# EasyEDA schematic RejsaCAN v6.0 - Schematic.json
TITLE: RejsaCAN v6.0; REV: 1.0; Date: 2023-11-16; Sheet: 1/1; Drawn By: MagnusT
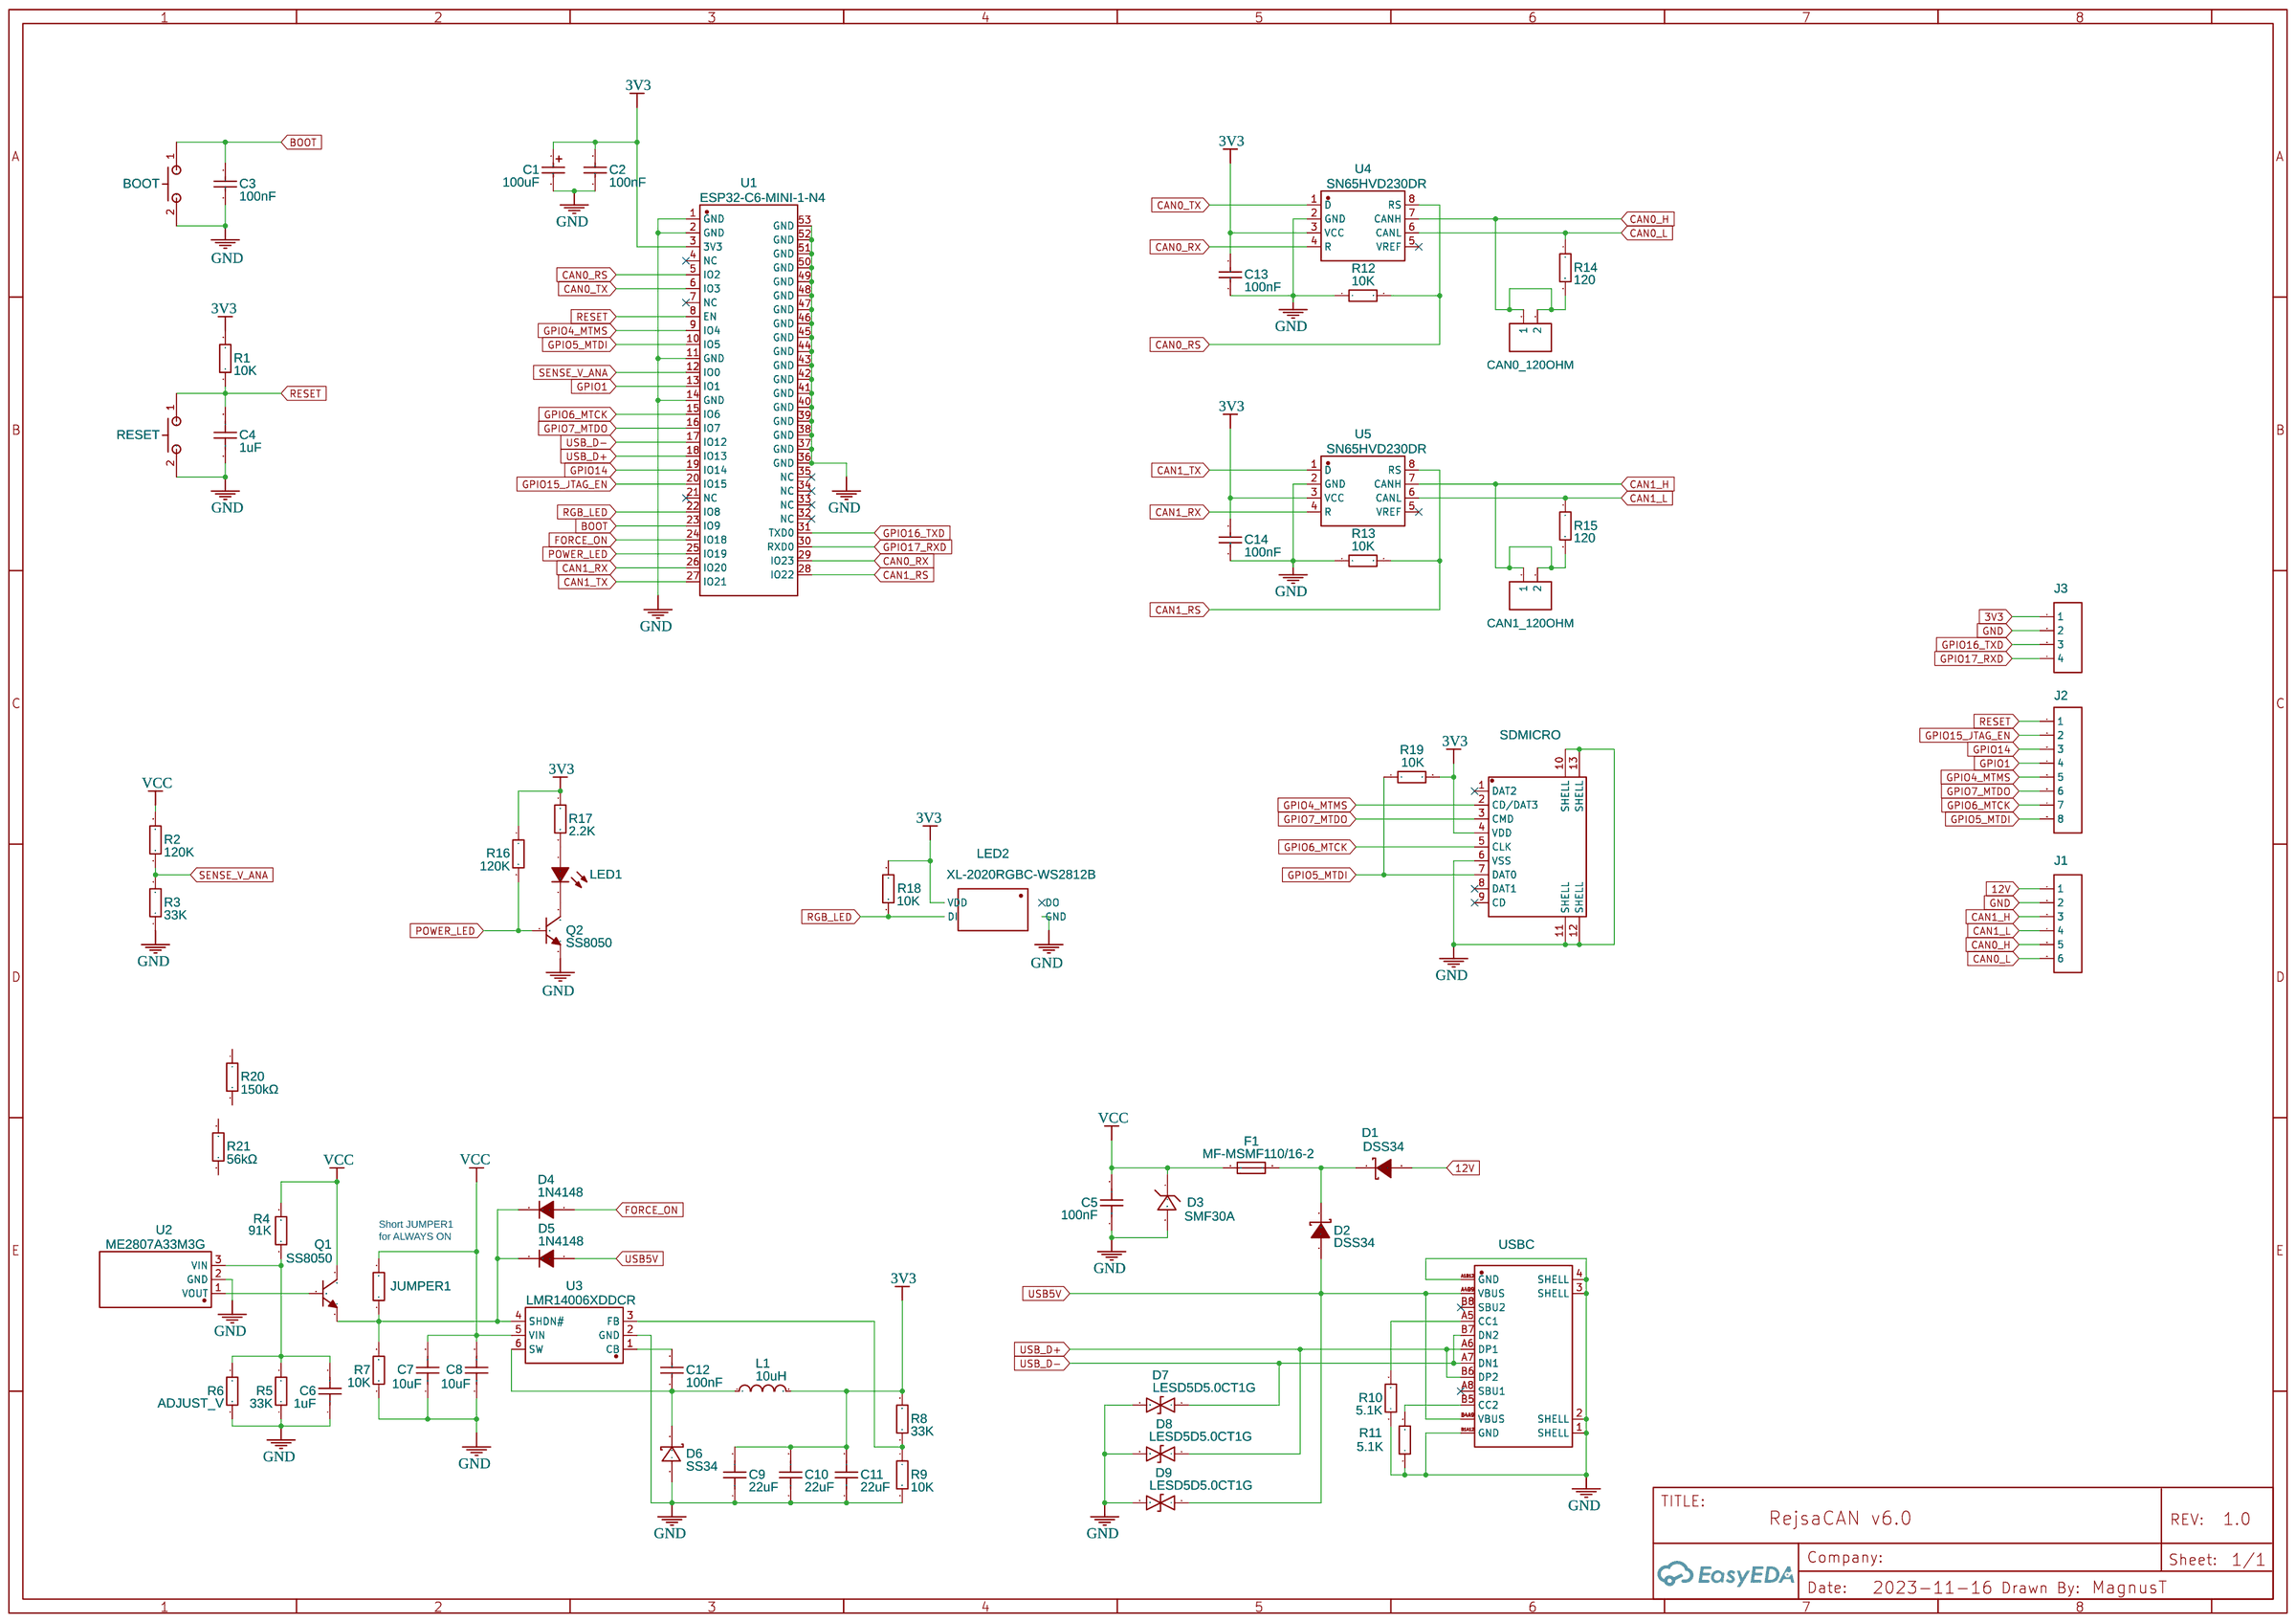
[diagram p0: schematic sheet]

## Parts
BOOT  GT-TC029B-H025-L1N  [SW-SMD_L3.9-W2.9-P4.15-LS5.0]
C1  100uF  [CASE-B_3528]
C2  100nF  [C0402_NEW]
C3  100nF  [C0402_NEW]
C4  1uF  [C0402]
C5  100nF  [C0402]
C6  1uF  [C0402]
C7  10uF  [C0805]
C8  10uF  [C0805]
C9  22uF  [C0603]
C10  22uF  [C0603]
C11  22uF  [C0603]
C12  100nF  [C0402_NEW]
C13  100nF  [C0402_NEW]
C14  100nF  [C0402_NEW]
CAN0_120OHM  HDR-M-2.54_1x2  [HDR-M-2.54_1X2]
CAN1_120OHM  HDR-M-2.54_1x2  [HDR-M-2.54_1X2]
D1  DSS34  [SOD-123_L2.8-W1.8-LS3.7-RD]
D2  DSS34  [SOD-123_L2.8-W1.8-LS3.7-RD]
D3  SMF30A  [SOD-123_L2.8-W1.8-LS3.7-RD]
D4  1N4148  [SOD-323_L1.8-W1.3-LS2.5-RD]
D5  1N4148  [SOD-323_L1.8-W1.3-LS2.5-RD]
D6  SS34  [DO-214AC_L4.3-W2.7-LS5.3-RD]
D7  LESD5D5.0CT1G  [SOD-523_L1.2-W0.8-LS1.6-BI]
D8  LESD5D5.0CT1G  [SOD-523_L1.2-W0.8-LS1.6-BI]
D9  LESD5D5.0CT1G  [SOD-523_L1.2-W0.8-LS1.6-BI]
F1  MF-MSMF110/16-2  [F1812]
J1  HDR-M-2.54_1x6  [HDR-M-2.54_1X6]
J2  HDR-M-2.54_1x8  [HDR-M-2.54_1X8]
J3  HDR-M-2.54_1x4  [HDR-M-2.54_1X4]
JUMPER1  CUT  [R0402]
L1  10uH  [IND-SMD_L6.0-W6.0_SLP6028S]
LED1  19-217/GHC-YR1S2/3T  [LED0603-R-RD]
LED2  XL-2020RGBC-WS2812B  [LED-SMD_4P-L2.0-W2.0-BR-1]
Q1  SS8050  [SOT-23-3_L2.9-W1.3-P1.90-LS2.4-BR]
Q2  SS8050  [SOT-23-3_L2.9-W1.3-P1.90-LS2.4-BR]
R1  10K  [R0402]
R2  120K  [R0402]
R3  33K  [R0402]
R4  91K  [R0402]
R5  33K  [R0402]
R6  ADJUST_V  [R0805]
R7  10K  [R0402]
R8  33K  [R0402]
R9  10K  [R0402]
R10  5.1K  [R0402]
R11  5.1K  [R0402]
R12  10K  [R0402]
R13  10K  [R0402]
R14  120  [R1206]
R15  120  [R1206]
R16  120K  [R0402]
R17  2.2K  [R0402]
R18  10K  [R0402]
R19  10K  [R0402]
R20  150kΩ  [R0402]
R21  56kΩ  [R0402]
RESET  GT-TC029B-H025-L1N  [SW-SMD_L3.9-W2.9-P4.15-LS5.0]
SDMICRO  TF-115  [TF-SMD_TF-115]
U1  ESP32-C6-MINI-1-N4  [WIFIM-SMD_ESP32-C3-MINI-1]
U2  ME2807A33M3G  [SOT-23_L2.9-W1.3-P1.90-LS2.4-BR]
U3  LMR14006XDDCR  [TSOT-23-6_L2.9-W1.6-P0.95-LS2.8-BL]
U4  SN65HVD230DR  [SOIC-8_L4.9-W3.9-P1.27-LS6.0-BL]
U5  SN65HVD230DR  [SOIC-8_L4.9-W3.9-P1.27-LS6.0-BL]
USBC  GT-USB-7010ASV  [USB-C-SMD_G-SWITCH_GT-USB-7010ASV]

## Library data of the parts
BOOT RESET = GT-TC029B-H025-L1N: Supplier: LCSC; Supplier Part: C843669; Manufacturer: G-Switch; Contributor: LCSC; JLCPCB Part Class: Extended Part; Package Display: No
C1 = TAJB107K006RNJ: Supplier: LCSC; Manufacturer: Kyocera AVX; Supplier Part: C16133; JLCPCB Part Class: Basic Part; link: https://lcsc.com/eda_search?q=C16133&%26type=1&ref=editor
C2 C3 C12-C14 = CL05B104KO5NNNC: Supplier: LCSC; Manufacturer: SAMSUNG; Supplier Part: C1525; JLCPCB Part Class: Basic Part; Package Display: No
C4 C6 = CL05A105KA5NQNC: Supplier: LCSC; Manufacturer: SAMSUNG; Supplier Part: C52923; JLCPCB Part Class: Basic Part; Package Display: No
C5 = CL05B104KB54PNC: Supplier: LCSC; Supplier Part: C307331; Manufacturer: Samsung Electro-Mechanics; Contributor: LCSC; JLCPCB Part Class: Basic Part
C7 C8 = CL21A106KBYQNNE: Contributor: lcsc; Supplier: LCSC; Supplier Part: C2932476; Manufacturer: SAMSUNG(三星); JLCPCB Part Class: Extended Part; link: https://lcsc.com/eda_search?q=C2932476&%26type=1&ref=editor
C9-C11 = CL10A226MQ8NRNC: Supplier: LCSC; Manufacturer: SAMSUNG; Supplier Part: C59461; JLCPCB Part Class: Basic Part; Package Display: No
CAN0_120OHM CAN1_120OHM = HDR-M-2.54_1x2: Supplier Part: C124375; Supplier: LCSC; Contributor: LCEDA_Lib
D1 D2 = DSS34: Supplier: LCSC; Manufacturer: STARSEA; Supplier Part: C84632; JLCPCB Part Class: Extended Part
D3 = SMF30A_C366558: Supplier: LCSC; Supplier Part: C366558; Manufacturer: DOWO; Contributor: LCSC; JLCPCB Part Class: Extended Part
D4 D5 = 1N4148WS T4: Supplier: LCSC; Manufacturer: CJ; Supplier Part: C2128; JLCPCB Part Class: Basic Part; Package Display: No
D6 = SS34_C8678: Supplier: LCSC; Manufacturer: MDD; Supplier Part: C8678; JLCPCB Part Class: Basic Part; Package Display: No
D7-D9 = LESD5D5.0CT1G: Supplier: LCSC; Supplier Part: C383211; Manufacturer: Leshan Radio; Contributor: LCSC; JLCPCB Part Class: Extended Part
F1 = MF-MSMF110/16-2: Contributor: LCSC; Supplier: LCSC; Supplier Part: C210834; Manufacturer: BOURNS; JLCPCB Part Class: Extended Part; link: https://lcsc.com/eda_search?q=C210834&%26type=1&ref=editor
J1 = HDR-M-2.54_1x6: Supplier Part: C190819; Supplier: LCSC; Contributor: LCEDA_Lib
J2 = HDR-M-2.54_1x8: Supplier Part: C190820; Supplier: LCSC; Contributor: LCEDA_Lib
J3 = HDR-M-2.54_1x4: Supplier Part: C124378; Supplier: LCSC; Contributor: LCEDA_Lib
JUMPER1 = 0402WGF3092TCE: Contributor: LCSC
L1 = SLP6028S100MTT: Supplier: LCSC; Supplier Part: C254862; Manufacturer: Sunltech Tech; Contributor: LCSC; JLCPCB Part Class: Extended Part
LED1 = 19-217/GHC-YR1S2/3T: Supplier: LCSC; Manufacturer: EVERLIGHT; Supplier Part: C72043; JLCPCB Part Class: Basic Part; Package Display: No
LED2 = XL-2020RGBC-WS2812B: Supplier: LCSC; Supplier Part: C5349955; Manufacturer: XINGLIGHT(成兴光); JLCPCB Part Class: Extended Part; Contributor: lcsc; link: https://lcsc.com/eda_search?q=C5349955&%26type=1&ref=editor
Q1 Q2 = SS8050_C2150: Supplier: LCSC; Manufacturer: CJ; Supplier Part: C2150; JLCPCB Part Class: Basic Part; Package Display: No
R1 R7 R9 R12 R13 R18 = 0402WGF1002TCE: Supplier: LCSC; Manufacturer: UniOhm; Supplier Part: C25744; JLCPCB Part Class: Basic Part; Package Display: No
R2 R16 = 0402WGF1203TCE: Supplier: LCSC; Manufacturer: UniOhm; Supplier Part: C25750; JLCPCB Part Class: Basic Part
R3 R5 R8 = 0402WGF3302TCE: Supplier: LCSC; Manufacturer: UniOhm; Supplier Part: C25779; JLCPCB Part Class: Basic Part
R4 = 0402WGF9102TCE: Supplier: LCSC; Manufacturer: UniOhm; Supplier Part: C4147; JLCPCB Part Class: Extended Part
R6 = RC0805JR-131KL: Contributor: lcsc
R10 R11 = 0402WGF5101TCE: Supplier: LCSC; Manufacturer: UniOhm; Supplier Part: C25905; JLCPCB Part Class: Basic Part
R14 R15 = RTT061200FTP: Supplier: LCSC; Manufacturer: RALEC; Contributor: LCSC; Supplier Part: C159715; JLCPCB Part Class: Extended Part; Package Display: No
R17 = 0402WGF2201TCE: Supplier: LCSC; Manufacturer: UniOhm; Supplier Part: C25879; JLCPCB Part Class: Basic Part; Package Display: No
R19 = 0402WGF1002TCE: Supplier: LCSC; Manufacturer: UniOhm; Supplier Part: C25744; JLCPCB Part Class: Basic Part
R20 = 0402WGF1503TCE: Supplier: LCSC; Manufacturer: UNI-ROYAL(厚声); Supplier Part: C25755; JLCPCB Part Class: Basic Part
R21 = 0402WGF5602TCE: Supplier: LCSC; Manufacturer: UNI-ROYAL(厚声); Supplier Part: C25796; JLCPCB Part Class: Basic Part
SDMICRO = TF-115: Contributor: LCSC; Supplier: LCSC; Supplier Part: C266620; Manufacturer: XUNPU(讯普); JLCPCB Part Class: Extended Part; link: https://lcsc.com/eda_search?q=C266620&%26type=1&ref=editor
U1 = ESP32-C3-MINI-1-H4(4MB): Contributor: lcsc; Supplier: LCSC; Supplier Part: C5736265; Manufacturer: ESPRESSIF(乐鑫); JLCPCB Part Class: Extended Part; link: https://lcsc.com/eda_search?q=C5736265&%26type=1&ref=editor
U2 = ME2807A33M3G: Supplier: LCSC; Supplier Part: C236755; Manufacturer: Nanjing Micro One Elec; Contributor: LCSC; JLCPCB Part Class: Extended Part
U3 = LMR14006XDDCR: Supplier: LCSC; Supplier Part: C478074; Manufacturer: Texas Instruments; Contributor: LCSC; JLCPCB Part Class: Extended Part
U4 U5 = SN65HVD230DR: Supplier: LCSC; Manufacturer: TI; Supplier Part: C12084; JLCPCB Part Class: Basic Part; Package Display: No
USBC = GT-USB-7010ASV: Contributor: lcsc; Supplier: LCSC; Supplier Part: C2988369; Manufacturer: G-Switch(品赞); JLCPCB Part Class: Extended Part; link: https://lcsc.com/eda_search?q=C2988369&%26type=1&ref=editor

## Nets
3V3: C1.1 C2.2 C9.2 C10.2 C11.2 C13.2 C14.2 J3.1 L1.2 LED2.4(VDD) R1.2 R8.2 R16.1 R17.1 R18.2 R19.2 SDMICRO.4(VDD) U1.3(3V3) U4.3(VCC) U5.3(VCC)
12V: D1.2(A) J1.1
GND: BOOT.2 C1.2 C2.1 C3.1 C4.1 C5.1 C6.1 C7.1 C8.1 C9.1 C10.1 C11.1 C13.1 C14.1 D3.2 D6.2(A) D7.2 D8.2 D9.2 J1.2 J3.2 LED2.2(GND) Q2.2(E) R3.1 R5.1 R6.2 R7.1 R9.2 R10.1 R11.1 R12.1 R13.1 RESET.2 SDMICRO.6(VSS) SDMICRO.10(SHELL) SDMICRO.11(SHELL) SDMICRO.12(SHELL) SDMICRO.13(SHELL) U1.1(GND) U1.2(GND) U1.11(GND) U1.14(GND) U1.36(GND) U1.37(GND) U1.38(GND) U1.39(GND) U1.40(GND) U1.41(GND) U1.42(GND) U1.43(GND) U1.44(GND) U1.45(GND) U1.46(GND) U1.47(GND) U1.48(GND) U1.49(GND) U1.50(GND) U1.51(GND) U1.52(GND) U1.53(GND) U2.2(GND) U3.2(GND) U4.2(GND) U5.2(GND) USBC.1(SHELL) USBC.2(SHELL) USBC.3(SHELL) USBC.4(SHELL) USBC.A1B12(GND) USBC.B1A12(GND)
VCC: C5.2 C7.2 C8.2 D3.1 F1.1 JUMPER1.2 Q1.3(C) R2.2 R4.2 U3.5(VIN)
BOOT: BOOT.1 C3.2 U1.23(IO9)
CAN0_H: CAN0_120OHM.1 CAN0_120OHM.2 J1.5 R14.2 U4.7(CANH)
CAN0_L: J1.6 R14.1 U4.6(CANL)
CAN0_RS: R12.2 U1.5(IO2) U4.8(RS)
CAN0_RX: U1.29(IO23) U4.4(R)
CAN0_TX: U1.6(IO3) U4.1(D)
CAN1_H: CAN1_120OHM.1 CAN1_120OHM.2 J1.3 R15.2 U5.7(CANH)
CAN1_L: J1.4 R15.1 U5.6(CANL)
CAN1_RS: R13.2 U1.28(IO22) U5.8(RS)
CAN1_RX: U1.26(IO20) U5.4(R)
CAN1_TX: U1.27(IO21) U5.1(D)
FORCE_ON: D4.2(A) U1.24(IO18)
GPIO1: J2.4 U1.13(IO1)
GPIO4_MTMS: J2.5 SDMICRO.2(CD/DAT3) U1.9(IO4)
GPIO5_MTDI: J2.8 R19.1 SDMICRO.7(DAT0) U1.10(IO5)
GPIO6_MTCK: J2.7 SDMICRO.5(CLK) U1.15(IO6)
GPIO7_MTDO: J2.6 SDMICRO.3(CMD) U1.16(IO7)
GPIO14: J2.3 U1.19(IO14)
GPIO15_JTAG_EN: J2.2 U1.20(IO15)
GPIO16_TXD: J3.3 U1.31(TXD0)
GPIO17_RXD: J3.4 U1.30(RXD0)
POWER_LED: Q2.1(B) R16.2 U1.25(IO19)
RESET: C4.2 J2.1 R1.1 RESET.1 U1.8(EN)
RGB_LED: LED2.3(DI) R18.1 U1.22(IO8)
SENSE_V_ANA: R2.1 R3.2 U1.12(IO0)
USB5V: D2.2(A) D5.2(A) D9.1 USBC.A4B9(VBUS) USBC.B4A9(VBUS)
USB_D+: D8.1 U1.18(IO13) USBC.A6(DP1) USBC.B6(DP2)
USB_D-: D7.1 U1.17(IO12) USBC.A7(DN1) USBC.B7(DN2)
Net-(C6-2): C6.2 R4.1 R5.2 R6.1 U2.3(VIN)
Net-(C12-1): C12.1 D6.1(K) L1.1 U3.6(SW)
Net-(C12-2): C12.2 U3.1(CB)
Net-(D1-1): D1.1(K) D2.1(K) F1.2
Net-(D4-1): D4.1(K) D5.1(K) JUMPER1.1 Q1.2(E) R7.2 U3.4(SHDN#)
Net-(LED1-1): LED1.1(A) R17.2
Net-(LED1-2): LED1.2(C) Q2.3(C)
Net-(Q1-1): Q1.1(B) U2.1(VOUT)
Net-(R8-1): R8.1 R9.1 U3.3(FB)
Net-(R10-2): R10.2 USBC.A5(CC1)
Net-(R11-2): R11.2 USBC.B5(CC2)

Not connected (* = marked no-connect by the designer): LED2 1(DO)*; R20 1 2; R21 1 2; SDMICRO 1(DAT2)* 8(DAT1)* 9(CD)*; U1 4(NC)* 7(NC)* 21(NC)* 32(NC)* 33(NC)* 34(NC)* 35(NC)*; U4 5(VREF)*; U5 5(VREF)*; USBC A8(SBU1)* B8(SBU2)*

## Notes on the sheet
- Short JUMPER1
  for ALWAYS ON
